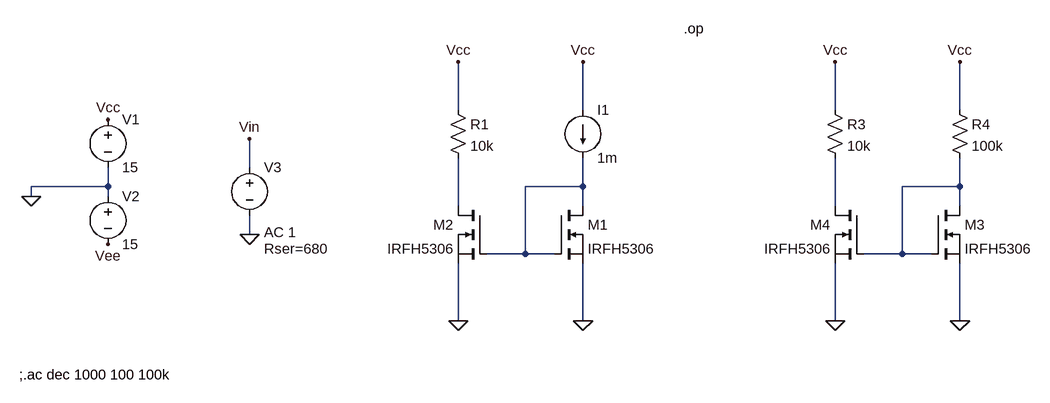
[diagram p0: schematic Draft2.asc]
Draft2.asc, the LTspice schematic file:
Version 4
SHEET 1 1200 680
WIRE 224 80 224 0
WIRE 432 80 432 0
WIRE 864 80 864 0
WIRE 1072 80 1072 0
WIRE -1616 176 -1616 128
WIRE -2192 208 -2192 176
WIRE -2192 208 -2320 208
WIRE 432 208 432 160
WIRE 432 208 336 208
WIRE 1072 208 1072 160
WIRE 1072 208 976 208
WIRE -2320 224 -2320 208
WIRE -2192 224 -2192 208
WIRE 224 240 224 160
WIRE 432 240 432 208
WIRE 864 240 864 160
WIRE 1072 240 1072 208
WIRE -1616 288 -1616 256
WIRE 336 320 336 208
WIRE 336 320 272 320
WIRE 384 320 336 320
WIRE 976 320 976 208
WIRE 976 320 912 320
WIRE 1024 320 976 320
WIRE 224 432 224 336
WIRE 432 432 432 336
WIRE 864 432 864 336
WIRE 1072 432 1072 336
FLAG -2192 96 Vcc
FLAG -2320 224 0
FLAG -2192 304 Vee
FLAG -1616 288 0
FLAG -1616 128 Vin
FLAG 224 0 Vcc
FLAG 432 0 Vcc
FLAG 432 432 0
FLAG 224 432 0
FLAG 864 0 Vcc
FLAG 1072 0 Vcc
FLAG 1072 432 0
FLAG 864 432 0
SYMBOL nmos 384 240 R0
SYMATTR InstName M1
SYMATTR Value IRFH5306
SYMBOL nmos 272 240 M0
SYMATTR InstName M2
SYMATTR Value IRFH5306
SYMBOL res 208 64 R0
SYMATTR InstName R1
SYMATTR Value 10k
SYMBOL voltage -2192 80 R0
WINDOW 123 0 0 Left 0
WINDOW 39 0 0 Left 0
SYMATTR InstName V1
SYMATTR Value 15
SYMBOL voltage -2192 208 R0
WINDOW 123 0 0 Left 0
WINDOW 39 0 0 Left 0
SYMATTR InstName V2
SYMATTR Value 15
SYMBOL voltage -1616 160 R0
WINDOW 123 24 124 Left 2
WINDOW 39 24 152 Left 2
SYMATTR InstName V3
SYMATTR Value ""
SYMATTR Value2 AC 1
SYMATTR SpiceLine Rser=680
SYMBOL nmos 1024 240 R0
SYMATTR InstName M3
SYMATTR Value IRFH5306
SYMBOL nmos 912 240 M0
SYMATTR InstName M4
SYMATTR Value IRFH5306
SYMBOL res 848 64 R0
SYMATTR InstName R3
SYMATTR Value 10k
SYMBOL res 1056 64 R0
SYMATTR InstName R4
SYMATTR Value 100k
SYMBOL current 432 80 R0
WINDOW 123 0 0 Left 0
WINDOW 39 0 0 Left 0
SYMATTR InstName I1
SYMATTR Value 1m
TEXT -2340 522 Left 2 !;.ac dec 1000 100 100k
TEXT 600 -56 Left 2 !.op

The netlist it stands for:
* Draft2.asc
M1 N001 N001 0 0 IRFH5306
M2 N003 N001 0 0 IRFH5306
R1 Vcc N003 10k
V1 Vcc 0 15
V2 0 Vee 15
V3 Vin 0 AC 1 Rser=680
M3 N002 N002 0 0 IRFH5306
M4 N004 N002 0 0 IRFH5306
R3 Vcc N004 10k
R4 Vcc N002 100k
I1 Vcc N001 1m
.model NMOS NMOS
.model PMOS PMOS
.lib standard.mos
;.ac dec 1000 100 100k
.op
.backanno
.end